# Altium schematic sheet Microcontroller.SchDoc: Microcontroller
size Letter; Date: 2017-07-12; DocumentNumber: 10; Revision: B; SheetNumber: 10; SheetTotal: 16; DesignedBy: Craig Comberbach
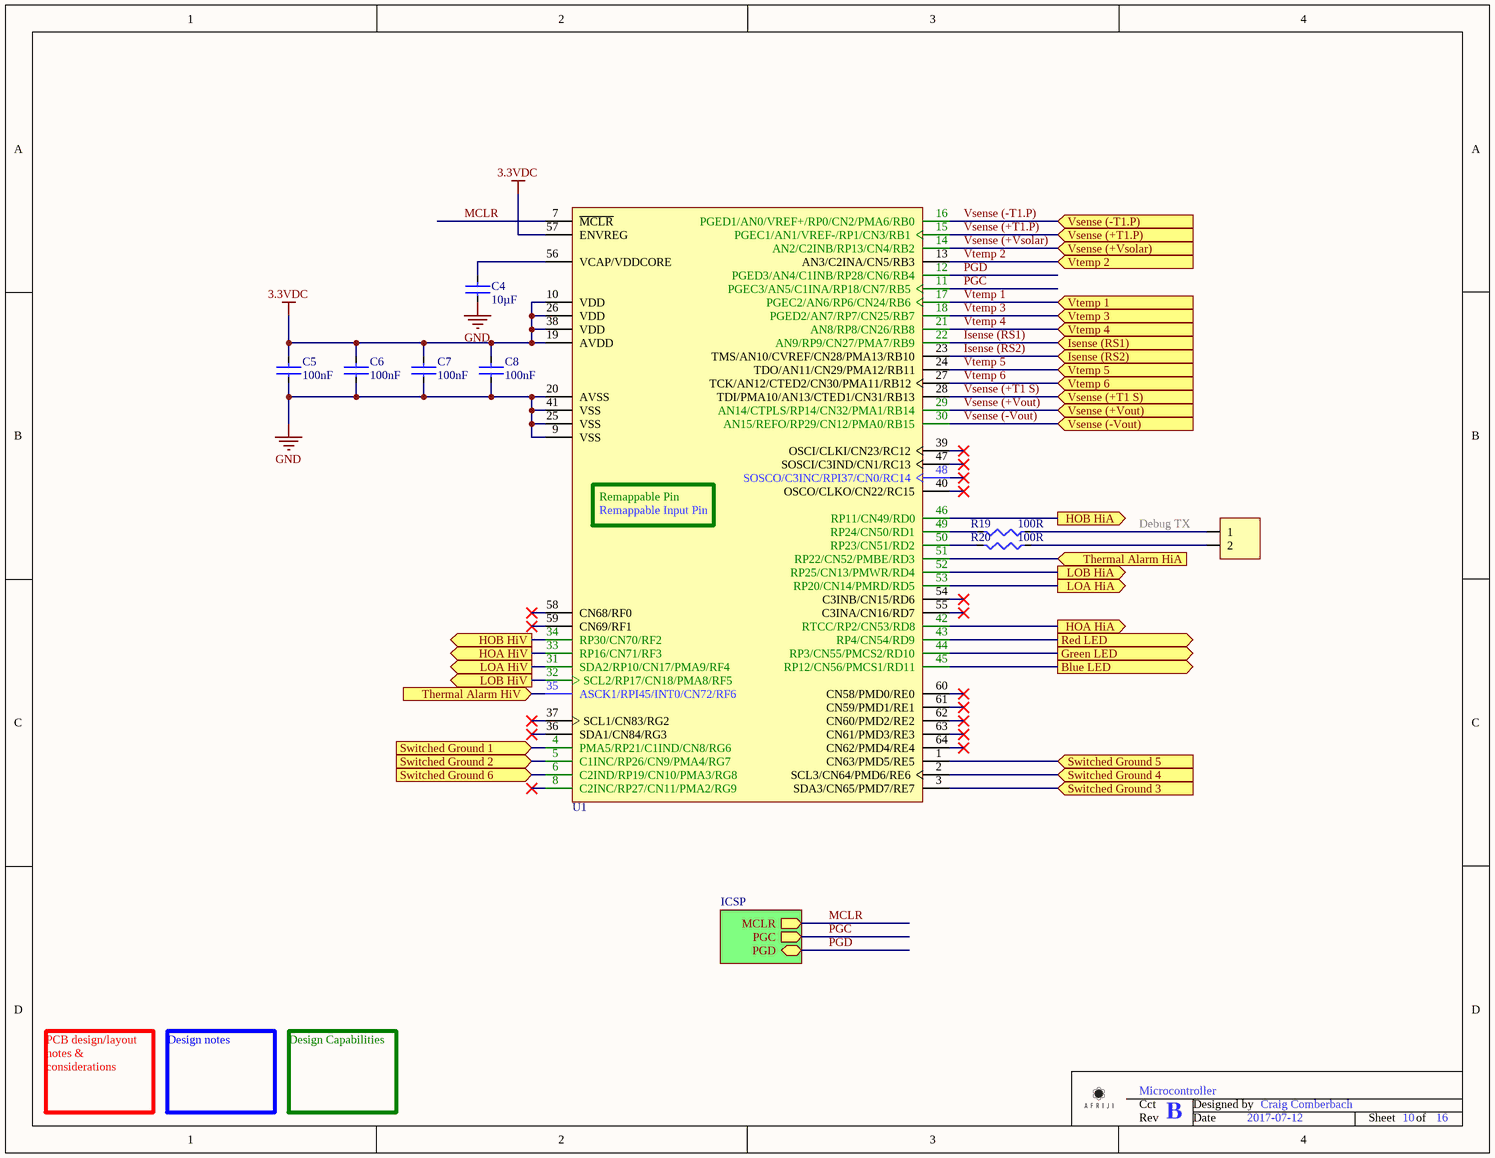
[diagram p0: Microcontroller.SchDoc]

## Parts
C4  Capacitance: 10µF  [C0805 - Ceramic]  (hidden comment: 10uF 0805 10V)
C5  Capacitance: 100nF  [C0603 - Ceramic]  (hidden comment: 100nF 0603 50V)
C6  Capacitance: 100nF  [C0603 - Ceramic]  (hidden comment: 100nF 0603 50V)
C7  Capacitance: 100nF  [C0603 - Ceramic]  (hidden comment: 100nF 0603 50V)
C8  Capacitance: 100nF  [C0603 - Ceramic]  (hidden comment: 100nF 0603 50V)
R19  Resistance (Ohms): 100R  [R0603]  (hidden comment: 100R 0603 1%)
R20  Resistance (Ohms): 100R  [R0603]  (hidden comment: 100R 0603 1%)
TP3  MTA100-2 with friction Lock  (value not drawn)
U1  PIC24FJ256GA106 Microprocessor  [TQFP - 64]  (value not drawn)

## Sub-sheets
ICSP = ICSP.SchDoc: MCLR (out), PGD (bidir), PGC (out)

## Ports
Blue LED (out), Green LED (out), HOA HiA (out), HOA HiV (out), HOB HiA (out), HOB HiV (out), Isense (RS1) (in), Isense (RS2) (in), LOA HiA (out), LOA HiV (out), LOB HiA (out), LOB HiV (out), Red LED (out), Switched Ground 1 (in), Switched Ground 2 (in), Switched Ground 3 (in), Switched Ground 4 (in), Switched Ground 5 (in), Switched Ground 6 (in), Thermal Alarm HiA (in), Thermal Alarm HiV (in), Vsense (+T1 S) (in), Vsense (+T1.P) (in), Vsense (+Vout) (in), Vsense (+Vsolar) (in), Vsense (-T1.P) (in), Vsense (-Vout) (in), Vtemp 1 (in), Vtemp 2 (in), Vtemp 3 (in), Vtemp 4 (in), Vtemp 5 (in), Vtemp 6 (in)

## Nets
3.3VDC: C5.1 C6.1 C7.1 C8.1 U1.10(VDD) U1.19(AVDD) U1.26(VDD) U1.38(VDD) U1.57(ENVREG)
GND: C4.2 C5.2 C6.2 C7.2 C8.2 U1.9(VSS) U1.20(AVSS) U1.25(VSS) U1.41(VSS)
Blue LED: U1.45(RP12/CN56/PMCS1/RD11) ; port Blue LED
Debug TX: R19.2 TP3.1
Green LED: U1.44(RP3/CN55/PMCS2/RD10) ; port Green LED
HOA HiA: U1.42(RTCC/RP2/CN53/RD8) ; port HOA HiA
HOA HiV: U1.33(RP16/CN71/RF3) ; port HOA HiV
HOB HiA: U1.46(RP11/CN49/RD0) ; port HOB HiA
HOB HiV: U1.34(RP30/CN70/RF2) ; port HOB HiV
Isense (RS1): U1.22(AN9/RP9/CN27/PMA7/RB9) ; port Isense (RS1)
Isense (RS2): U1.23(TMS/AN10/CVREF/CN28/PMA13/RB10) ; port Isense (RS2)
LOA HiA: U1.53(RP20/CN14/PMRD/RD5) ; port LOA HiA
LOA HiV: U1.31(SDA2/RP10/CN17/PMA9/RF4) ; port LOA HiV
LOB HiA: U1.52(RP25/CN13/PMWR/RD4) ; port LOB HiA
LOB HiV: U1.32(SCL2/RP17/CN18/PMA8/RF5) ; port LOB HiV
MCLR: U1.7(~{MCLR}) ; sheet ICSP/MCLR
PGC: U1.11(PGEC3/AN5/C1INA/RP18/CN7/RB5) ; sheet ICSP/PGC
PGD: U1.12(PGED3/AN4/C1INB/RP28/CN6/RB4) ; sheet ICSP/PGD
Red LED: U1.43(RP4/CN54/RD9) ; port Red LED
Switched Ground 1: U1.4(PMA5/RP21/C1IND/CN8/RG6) ; port Switched Ground 1
Switched Ground 2: U1.5(C1INC/RP26/CN9/PMA4/RG7) ; port Switched Ground 2
Switched Ground 3: U1.3(SDA3/CN65/PMD7/RE7) ; port Switched Ground 3
Switched Ground 4: U1.2(SCL3/CN64/PMD6/RE6) ; port Switched Ground 4
Switched Ground 5: U1.1(CN63/PMD5/RE5) ; port Switched Ground 5
Switched Ground 6: U1.6(C2IND/RP19/CN10/PMA3/RG8) ; port Switched Ground 6
Thermal Alarm HiA: U1.51(RP22/CN52/PMBE/RD3) ; port Thermal Alarm HiA
Thermal Alarm HiV: U1.35(ASCK1/RPI45/INT0/CN72/RF6) ; port Thermal Alarm HiV
Vsense (+T1 S): U1.28(TDI/PMA10/AN13/CTED1/CN31/RB13) ; port Vsense (+T1 S)
Vsense (+T1.P): U1.15(PGEC1/AN1/VREF-/RP1/CN3/RB1) ; port Vsense (+T1.P)
Vsense (+Vout): U1.29(AN14/CTPLS/RP14/CN32/PMA1/RB14) ; port Vsense (+Vout)
Vsense (+Vsolar): U1.14(AN2/C2INB/RP13/CN4/RB2) ; port Vsense (+Vsolar)
Vsense (-T1.P): U1.16(PGED1/AN0/VREF+/RP0/CN2/PMA6/RB0) ; port Vsense (-T1.P)
Vsense (-Vout): U1.30(AN15/REFO/RP29/CN12/PMA0/RB15) ; port Vsense (-Vout)
Vtemp 1: U1.17(PGEC2/AN6/RP6/CN24/RB6) ; port Vtemp 1
Vtemp 2: U1.13(AN3/C2INA/CN5/RB3) ; port Vtemp 2
Vtemp 3: U1.18(PGED2/AN7/RP7/CN25/RB7) ; port Vtemp 3
Vtemp 4: U1.21(AN8/RP8/CN26/RB8) ; port Vtemp 4
Vtemp 5: U1.24(TDO/AN11/CN29/PMA12/RB11) ; port Vtemp 5
Vtemp 6: U1.27(TCK/AN12/CTED2/CN30/PMA11/RB12) ; port Vtemp 6
NetC4_1: C4.1 U1.56(VCAP/VDDCORE)
NetR19_1: R19.1 U1.49(RP24/CN50/RD1)
NetR20_1: R20.1 U1.50(RP23/CN51/RD2)
NetR20_2: R20.2 TP3.2

Not connected (* = marked no-connect by the designer): U1 8(C2INC/RP27/CN11/PMA2/RG9)* 36(SDA1/CN84/RG3)* 37(SCL1/CN83/RG2)* 39(OSCI/CLKI/CN23/RC12)* 40(OSCO/CLKO/CN22/RC15)* 47(SOSCI/C3IND/CN1/RC13)* 48(SOSCO/C3INC/RPI37/CN0/RC14)* 54(C3INB/CN15/RD6)* 55(C3INA/CN16/RD7)* 58(CN68/RF0)* 59(CN69/RF1)* 60(CN58/PMD0/RE0)* 61(CN59/PMD1/RE1)* 62(CN60/PMD2/RE2)* 63(CN61/PMD3/RE3)* 64(CN62/PMD4/RE4)*

## Notes on the sheet
- PCB design/layout notes & considerations
- Design notes
- Design Capabilities
- Cct
- Designed by
- Rev
- Date
- Sheet
- of
- (in symbol PIC24FJ256GA106 Microprocessor) Remappable Pin; Remappable Input Pin

## Library data of the parts
C4 = 10uF 0805 10V: Manufacturer: Kemet; Manufacturer Part Number: C0805C106K8PACTU; Tolerance: ±10%; Temperature Coefficient: X5R; Value: 10uF 0805 10V; Supplier 1: Digi-Key; RoHS: RoHS Compliant; Category: Capacitors; Stock 1: 215894; Pricing 1: 1=0.21, 10=0.14, 50=0.085, 100=0.0714, 250=0.0578, 500=0.051, 1000=0.04335 (USD); Packaging: Cut Tape (CT); Voltage - Rated: 10V; Mounting Type: Surface Mount, MLCC; Operating Temperature: -55°C ~ 85°C; Applications: General Purpose; Ratings: -; Package / Case: 0805 (2012 Metric); Size / Dimension: 0.079" L x 0.049" W (2.00mm x 1.25mm); Height - Seated (Max): -; Thickness (Max): 0.055" (1.40mm); Lead Spacing: -; Features: -; Lead Style: -; ComponentLink1URL: http://www.kemet.com/docfinder?Partnumber=C0805C106K8PACTU; ComponentLink1Description: Spec Sheet; Supplier Part Number 1: 399-4925-1-ND
C5-C8 = 100nF 0603 50V: Manufacturer: Samsung Electro-Mechanics America, Inc; Manufacturer Part Number: CL10B104KB8SFNC; Tolerance: ±10%; Temperature Coefficient: X7R; Value: 100nF 0603 50V; Supplier 1: Digi-Key; RoHS: RoHS Compliant; Category: Capacitors; Stock 1: 1192070; Pricing 1: 1=0.1, 10=0.027, 25=0.0192, 100=0.0125, 500=0.00874, 1000=0.00681 (USD); Packaging: Cut Tape (CT); Voltage - Rated: 50V; Mounting Type: Surface Mount, MLCC; Operating Temperature: -55°C ~ 125°C; Applications: Boardflex Sensitive; Ratings: -; Package / Case: 0603 (1608 Metric); Size / Dimension: 0.063" L x 0.031" W (1.60mm x 0.80mm); Height - Seated (Max): -; Thickness (Max): 0.035" (0.90mm); Lead Spacing: -; Features: Soft Termination; Lead Style: -; ComponentLink1URL: http://www.samsungsem.com/kr/front/downloadcms.do?path=/kr/support/product-search/mlcc/__icsFiles/afieldfile/2014/11/05&fileName=S_CL10B104KB8SFNC.pdf; ComponentLink1Description: Spec Sheet; Supplier Part Number 1: 1276-1936-1-ND
R19 R20 = 100R 0603 1%: 1/8W; Manufacturer: Yageo; Manufacturer Part Number: RC0603FR-07100RL; Power (Watts): 0.1W, 1/10W; Temperature Coefficient: ±100ppm/°C; Value: 100R 0603 1%; Supplier 1: Digi-Key; RoHS: RoHS Compliant; Category: Resistors; Stock 1: 2116183; Pricing 1: 1=0.1, 10=0.015, 25=0.0108, 100=0.006, 250=0.00456, 500=0.00364, 1000=0.00268, 2500=0.00233 (USD); Packaging: Cut Tape (CT); Tolerance: ±1%; Composition: Thick Film; Features: Moisture Resistant; Operating Temperature: -55°C ~ 155°C; Package / Case: 0603 (1608 Metric); Supplier Device Package: 0603; Size / Dimension: 0.063" L x 0.031" W (1.60mm x 0.80mm); Height: 0.022" (0.55mm); Number of Terminations: 2; ComponentLink1URL: http://www.yageo.com/NewPortal/yageodocoutput?fileName=/pdf/R-Chip/PYu-RC_Group_51_RoHS_L_0.pdf; ComponentLink1Description: http://www.yageo.com/NewPortal/yageodocoutput?fileName=/pdf/R-Chip/PYu-RC_Group_51_RoHS_L_0.pdf; Supplier Part Number 1: 311-100HRCT-ND
TP3 = MTA100-2 with friction Lock: Manufacturer: TE Connectivity AMP Connectors; Manufacturer Part Number: 640456-2; Connector Type: Header; Pitch - Mating: 0.100" (2.54mm); Style: Board to Cable/Wire; Shrouding: Shrouded - 1 Wall; Number of Positions: 2; Number of Positions Loaded: All; Contact Length - Mating: 0.295" (7.49mm); Contact Length - Post: 0.140" (3.56mm); Overall Contact Length: 0.535" (13.59mm); Material Flammability Rating: UL94 V-0; Current Rating: Varies by Wire Gauge; Voltage Rating: 250VAC; Value: MTA100-2 with friction Lock; Supplier 1: Digi-Key; RoHS: RoHS Compliant; Category: Connectors, Interconnects; Stock 1: 177276; Pricing 1: 1=0.12, 10=0.117, 50=0.0748, 100=0.0724, 250=0.0624, 500=0.05992, 1000=0.05243, 2500=0.04744 (USD); Packaging: Bulk; Part Status: Active; Mounting Type: Through Hole; ComponentLink1URL: http://www.te.com/commerce/DocumentDelivery/DDEController?Action=srchrtrv&DocNm=640456&DocType=Customer+Drawing&DocLang=English; ComponentLink1Description: Spec Sheet; Supplier Part Number 1: A1921-ND; Contact Type: Male Pin; Number of Rows: 1; Row Spacing - Mating: -; Termination: Solder; Fastening Type: Friction Lock; Insulation Height: 0.305" (7.75mm); Contact Shape: Square; Contact Finish - Mating: Tin; Contact Finish Thickness - Mating: -; Contact Finish - Post: Tin; Contact Material: Copper Alloy; Insulation Material: Thermoplastic; Features: -; Operating Temperature: -55°C ~ 105°C; Ingress Protection: -; Insulation Color: Natural; Mated Stacking Heights: -; Contact Finish Thickness - Post: -; Applications: General Purpose
U1 = PIC24FJ256GA106 Microprocessor: General Purpose 16-Bit Flash Microcontroller, 256KB Flash, 16KB SRAM, 64-Pin TQFP, Industrial Temperature; Manufacturer: Microchip Technology; Manufacturer Part Number: PIC24FJ256GA106-I/PT; Core Processor: PIC; Speed: 32MHz; Connectivity: I²C, PMP, SPI, UART/USART; Peripherals: Brown-out Detect/Reset, LVD, POR, PWM, WDT; Number of I/O: 53; Program Memory Size: 256KB (85.5K x 24); RAM Size: 16K x 8; Voltage - Supply (Vcc/Vdd): 2 V ~ 3.6 V; Data Converters: A/D 16x10b; Oscillator Type: Internal; Value: PIC24FJ256GA106 Microprocessor; Technology: SMT; Supplier 1: Digi-Key; Supplier Part Number 1: PIC24FJ256GA106-I/PT-ND; RoHS: RoHS Compliant; Category: Integrated Circuits (ICs); Stock 1: 6379; Pricing 1: 1=7.45, 10=6.201, 25=5.6864, 100=5.1477 (CAD); Packaging: Tray; Core Size: 16-Bit; Program Memory Type: FLASH; EEPROM Size: -; Operating Temperature: -40°C ~ 85°C; Package / Case: 64-TQFP; Supplier Device Package: 64-TQFP (10x10); ComponentLink1URL: http://www.microchip.com/mymicrochip/filehandler.aspx?ddocname=en534317; ComponentLink1Description: Spec Sheet